# Altium schematic sheet Camera Connector.schdoc
size 127 x 99 mm
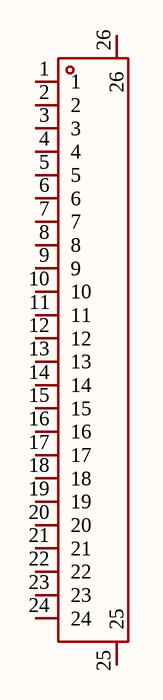
[diagram p0: Camera Connector.schdoc]

## Parts
FPC?  FPC-05FB-24PH20  [FPC-SMD_24P-P0.50_FPC-05FB-24PH20]  (value not drawn)

## Nets

Not connected (* = marked no-connect by the designer): FPC? 1 2 3 4 5 6 7 8 9 10 11 12 13 14 15 16 17 18 19 20 21 22 23 24 25 26

## Library data of the parts
FPC? = FPC-05FB-24PH20: Manufacturer: XUNPU(讯普); Add into BOM: yes; Locking Feature: Clamshell; Number of Contacts: 24P; Pitch: 0.5mm; FFC, FCB Thickness: 0.3mm; Symbol: FPC-05FB-24PH20; Device: FPC-05FB-24PH20; LCSC Part Name: 间距:0.5mm P数:24P 翻盖式 双侧触点/上下接; Supplier Part: C2856831; Manufacturer Part: FPC-05FB-24PH20; Supplier Footprint: SMD,P=0.5mm,卧贴; JLCPCB Part Class: Extended Part; Datasheet: https://atta.szlcsc.com/upload/public/pdf/source/20210922/C2856831_717985F95873A81D5C0B7E3F2E5E5327.pdf; Supplier: LCSC; Convert to PCB: yes; Contact Type: Double-sided contacts/up and down connection; Mounting Type: 卧贴; Height Above Board: 2mm; Operating Temperature Range: -25℃~+85℃